# EAGLE design MD2_SE Colour Fix - PAL rev2 (EAGLE 7.3.0)
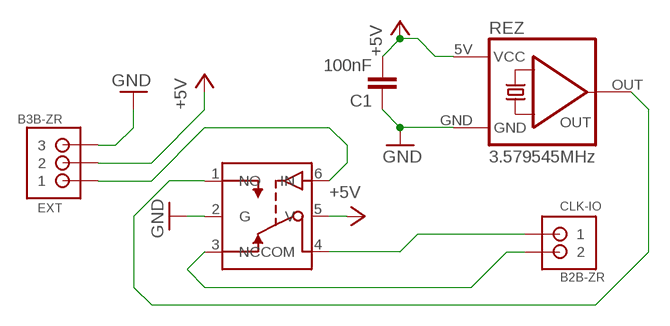
[diagram p0: schematic, sheet 1]

## Parts
C1  100nF  C-EUC0603K  [C0603K]
CLK-IO  B2B-ZR  [B2B-ZR]
EXT  B3B-ZR  [B3B-ZR]
REZ  3.579545MHz  QG5860  [DIL14S]
SWITCH  TS5A3157EUT-T  [SOT23-6]

## Nets
+5V: C1.2 EXT.2 REZ.5V(VCC) SWITCH.5(V)
GND: C1.1 EXT.3 REZ.GND SWITCH.2(G)
N$1: EXT.1 SWITCH.6(IN)
N$3: CLK-IO.2 SWITCH.3(NC)
NTSC: REZ.OUT SWITCH.1(NO)
OUT: CLK-IO.1 SWITCH.4(COM)

## Library data of the parts
C1 = rcl:C-EU: CAPACITOR, European symbol
CLK-IO = Mine:B2B-ZR: JST-ZH Connector 2 pol, 1.5mm pitch Package: B3B-ZR Source: http://www.jst-mfg.com/product/pdf/eng/eZH.pdf
EXT = Mine:B3B-ZR: JST-ZH Connector 3 pol, 1.5mm pitch Package: B3B-ZR Source: http://www.jst-mfg.com/product/pdf/eng/eZH.pdf
REZ = Mine:QG5860: CRYSTAL RESONATOR; OC_FARNELL: unknown; OC_NEWARK: unknown
SWITCH = Mine:TS5A3157

## Board
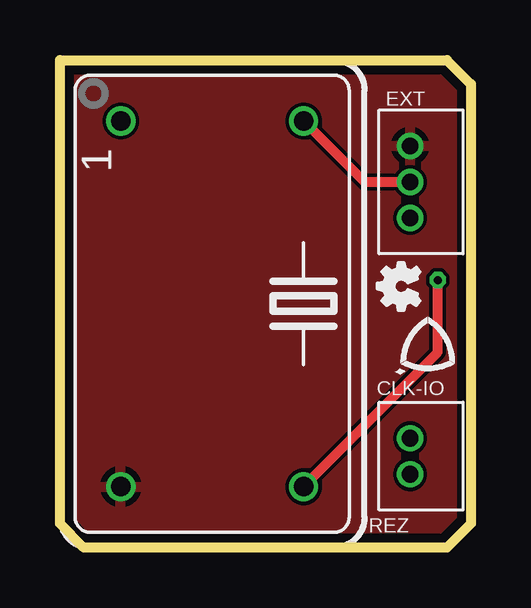
[diagram p1: board, top side]
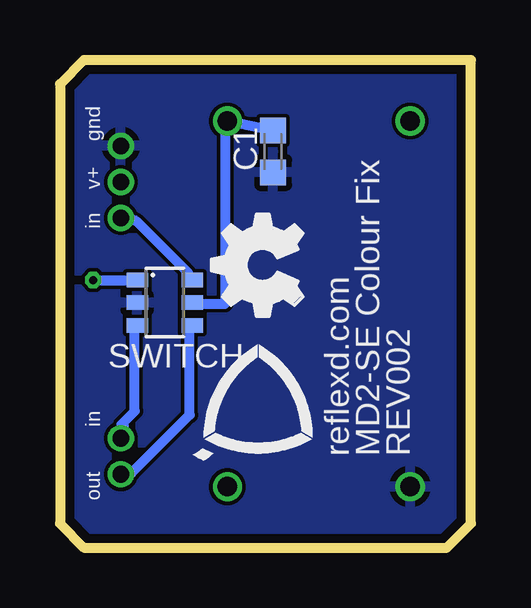
[diagram p2: board, bottom side, seen from below]

Size 17.14 x 20.32 mm. Coordinates in mm from the lower left corner, seen from the top.
Outline: 0,20.32 16.15,20.32 17.14,19.32 17.14,1 16.15,0 1,0 0,1 0,20.32
Copper layers (1*16): Top 0.0356mm / dielectric 1.5011mm / Bottom 0.0356mm
Design rules "TweakedLaenPCBOrder": minimum track width 6mil, minimum drill 13mil, track to track 6mil, track to pad 6mil, pad to pad 6mil, via to via 6mil, smd to smd 6mil, copper to edge 15mil, drill to drill 6mil, minimum pad ring 7mil, minimum via ring 7mil, stop-mask expansion 3mil, vias tented up to drill 15mil, thermal gap 10mil

### Footprints (pad centres in the part's own frame; a part is rotated, then mirrored left to right if it is on the bottom)
C0603K = smd 1.05 x 1.08: 1 -0.875,0; 2 0.875,0
B2B-ZR = drill 0.7 pad 1.1: 1 -0.75,0; 2 0.75,0
B3B-ZR = drill 0.7 pad 1.1: 1 -1.5,0; 2 0,0; 3 1.5,0
DIL14S = drill 0.813: 5V -7.62,3.81; GND 7.62,-3.81; NONE -7.62,-3.81; OUT 7.62,3.81
SOT23-6 = smd 0.6 x 0.9: 1 -0.95,-1.15; 2 0,-1.15; 3 0.95,-1.15; 4 0.95,1.15; 5 0,1.15; 6 -0.95,1.15

### Placement (x,y rotation side)
C1  8.26,16.51 90 bottom
CLK-IO  14.6,3.81 90 top
EXT  14.6,15.24 90 top
REZ  6.35,10.16 270 top
SWITCH  12.77,10.21 270 bottom
U$1  [LOGO-2.5MM]  15.35,8.14 90 top
U$2  [LOGO-5MM-BOTTOM]  8.89,5.08 270 top
U$3  [OSHW_FILLX70_NOTEXT]  15.01,9.9 90 top
U$4  [OSHW_FILLX150_NOTEXT]  7.01,9.65 90 bottom

### Tracks (layer width: path | path; a pad name or v marks a point on that pad's centre or on a via)
+5V
  Top 0.406: EXT.2 12.7,15.24 REZ.5V
  Bottom 0.152: 11.58,10.26 SWITCH.5 11.51,10.15 11.26,10.15 | 10.26,17.65 REZ.5V
  Bottom 0.406: REZ.5V C1.2 | 11.26,10.15 10.26,10.15 10.26,17.65
GND
  pour Bottom: 0,20.32 16.15,20.32 17.14,19.32 17.14,1 16.15,0 1,0 0,1
  pour Top: 0,20.32 0,1 1,0 16.15,0 17.14,1 17.14,19.32 16.15,20.32
N$1
  Bottom 0.152: 11.74,11.18 SWITCH.6
  Bottom 0.406: 11.74,11.18 11.79,11.43 13.98,13.61 EXT.1
N$3
  Bottom 0.152: 14.58,5.13 14.58,4.98 14.48,5.08 | 14.02,9.2 SWITCH.3 | 14.48,4.62 CLK-IO.2
  Bottom 0.406: 14.02,9.2 14.02,5.69 14.58,5.13 | 14.48,4.62 14.48,5.08
NTSC  (via drill 0.33)
  Top 0.152: 10.26,2.65 REZ.OUT
  Top 0.406: v15.76,11.15 15.76,8.15 10.26,2.65
  Bottom 0.152: 14.01,11.15 SWITCH.1
  Bottom 0.406: v15.76,11.15 14.01,11.15
OUT
  Bottom 0.152: 14.17,3.1 14.48,3.1 CLK-IO.1 | 11.74,9.2 SWITCH.4
  Bottom 0.254: 14.6,3.18 CLK-IO.1
  Bottom 0.406: 11.74,9.2 11.74,5.54 14.17,3.1

### Text on the board
bNames: gnd | v+ | in | in | REV002 | MD2-SE Colour Fix | reflexd.com | out